# Altium schematic sheet Sheet1.SchDoc
size A3; SheetNumber: 1; SheetTotal: 1
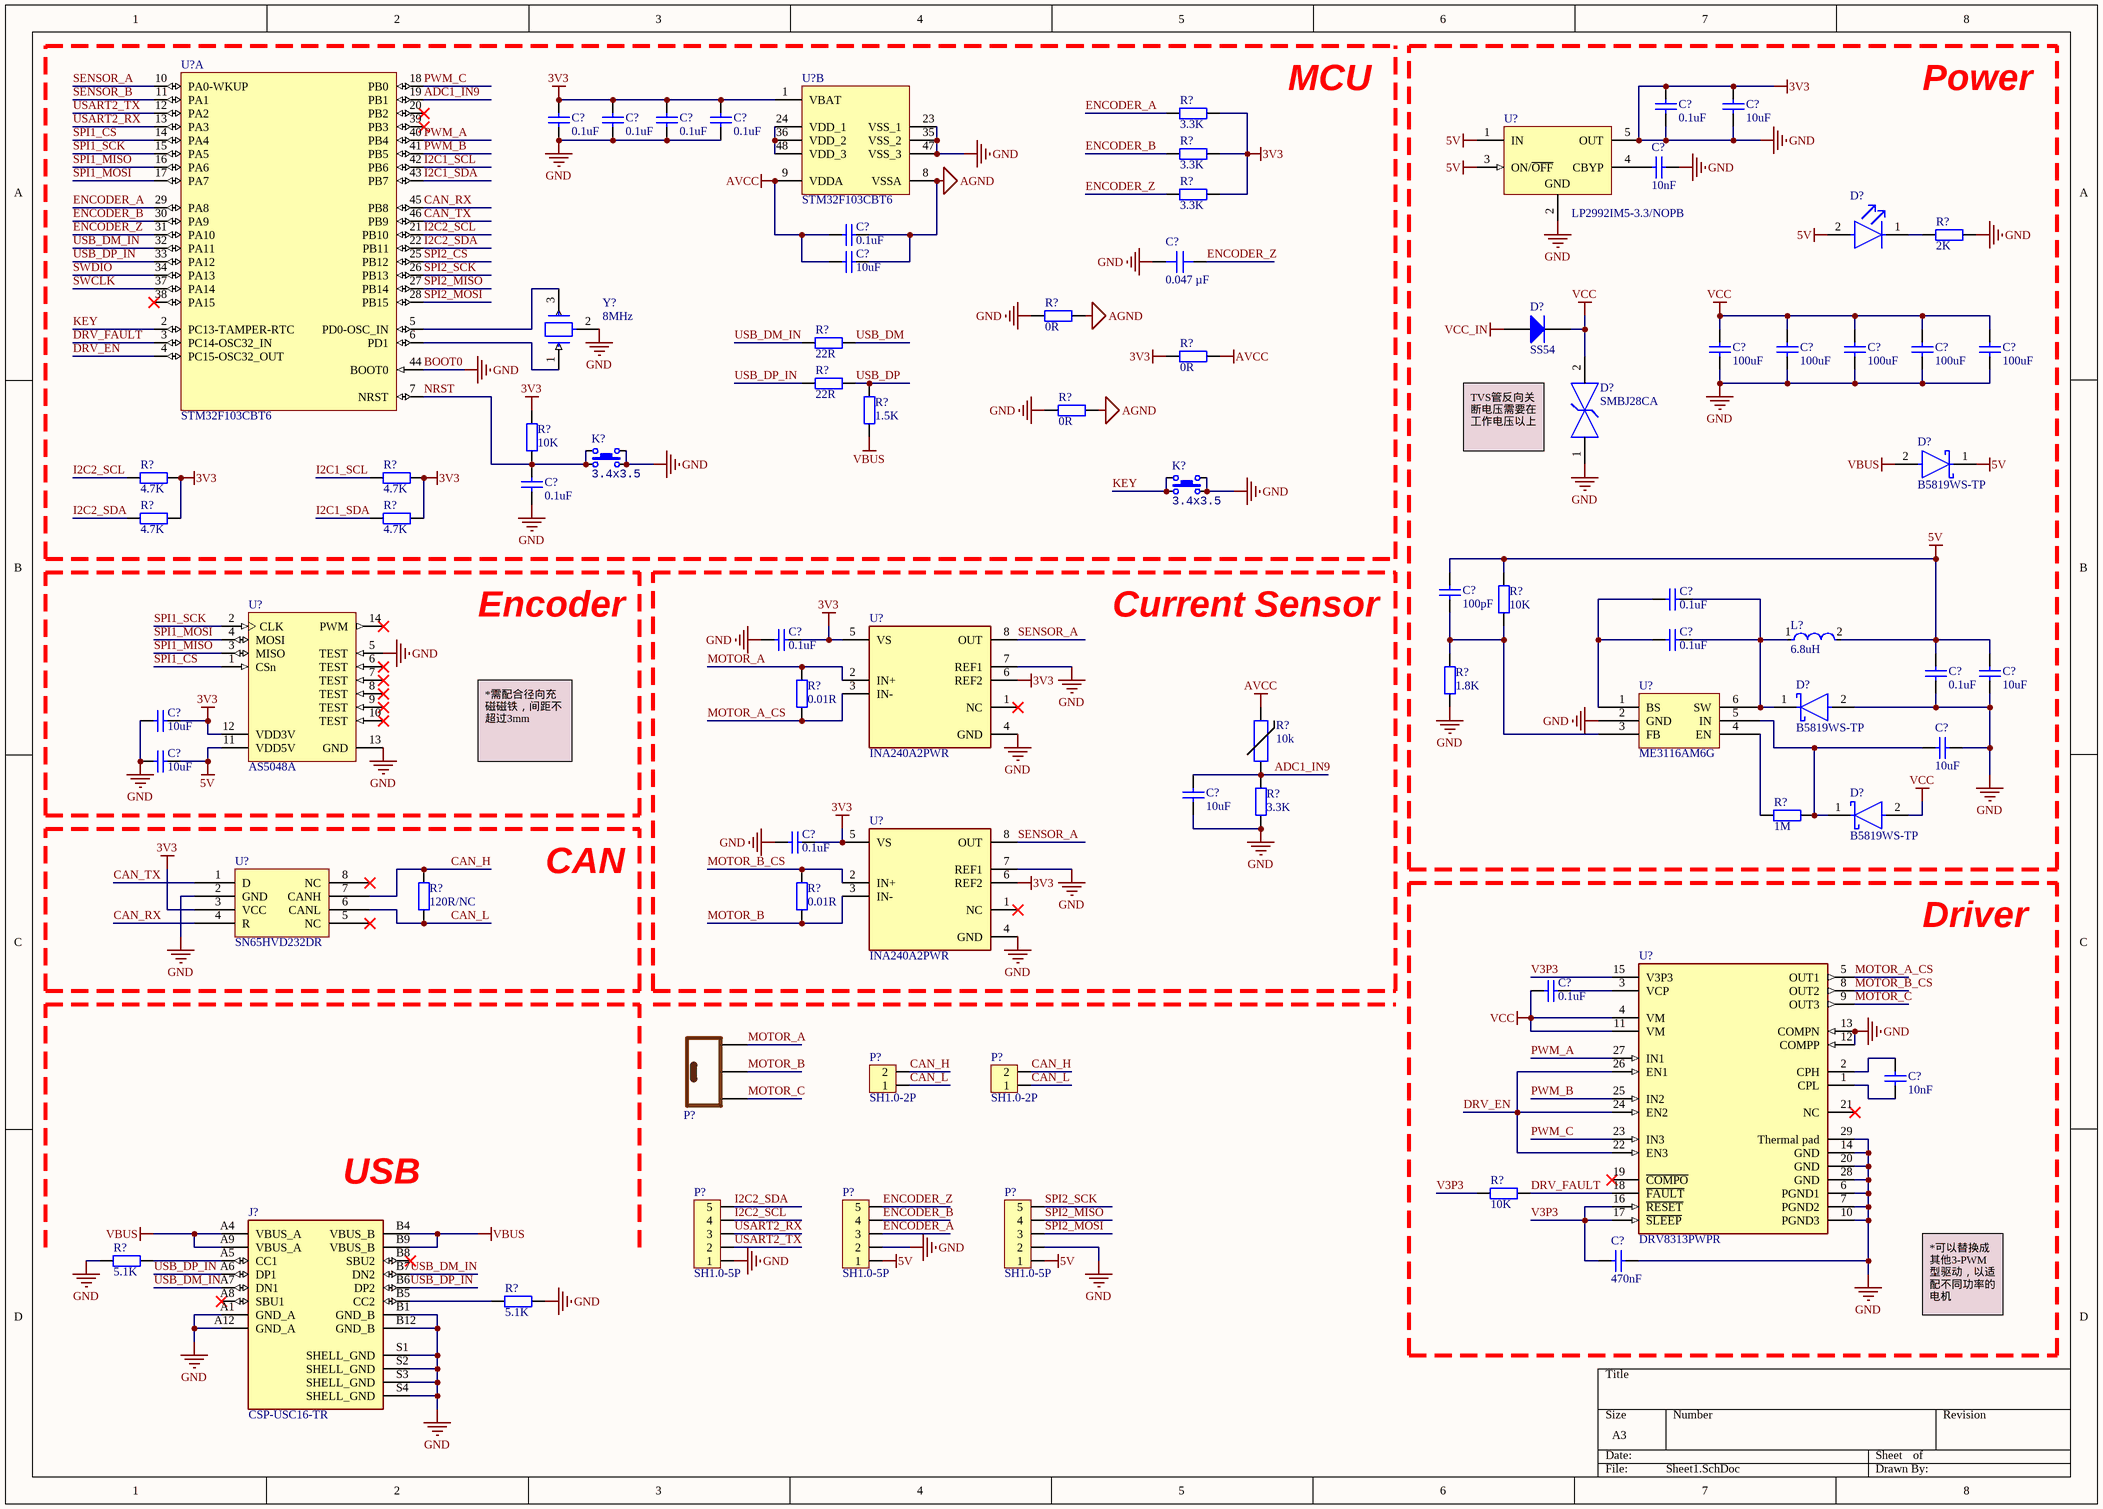
[diagram p0: Sheet1.SchDoc]

## Parts
(Parts that share a designator on the sheet are numbered #1, #2 ... from top to bottom, then left to right.)
C?#1  0.1uF  [0402_C]
C?#2  0.1uF  [0402_C]
C?#3  0.1uF  [0402_C]
C?#4  0.1uF  [0402_C]
C?#5  0.1uF  [0402_C]
C?#6  10uF  [0402_C]
C?#7  10nF  [0402_C]
C?#8  0.1uF  [0402_C]
C?#9  10uF  [0402_C]
C?#10  0.047 µF  [CAP 0402_1005]
C?#11  100uF  [CAPC3216X190X55LL30T25]
C?#12  100uF  [CAPC3216X190X55LL30T25]
C?#13  100uF  [CAPC3216X190X55LL30T25]
C?#14  100uF  [CAPC3216X190X55LL30T25]
C?#15  100uF  [CAPC3216X190X55LL30T25]
C?#16  0.1uF  [0402_C]
C?#17  0.1uF  [0402_C]
C?#18  0.1uF  [0402_C]
C?#19  0.1uF  [0402_C]
C?#20  100pF  [0402_C]
C?#21  0.1uF  [0402_C]
C?#22  10uF  [0402_C]
C?#23  10uF  [0402_C]
C?#24  10uF  [0402_C]
C?#25  10uF  [0402_C]
C?#26  10uF  [0402_C]
C?#27  0.1uF  [0402_C]
C?#28  0.1uF  [0402_C]
C?#29  10nF  [0402_C]
C?#30  470nF  [0402_C]
D?#1  (no value)  [FP-APHHS1005CGCK-MFG]
D?#2  SS54  [SMA(DO-214AC)_S1]
D?#3  SMBJ28CA  [FP-SMBJ-CA-MFG]
D?#4  B5819WS-TP  [FP-SOD-323-IPC_C]
D?#5  B5819WS-TP  [FP-SOD-323-IPC_C]
D?#6  B5819WS-TP  [FP-SOD-323-IPC_C]
J?  CSP-USC16-TR  [VALCON_CSP-USC16-TR]
K?#1  value 3.4x3.5  [ButtonTACT_3.5*3.55_90]  (hidden comment: TACT 4P)
K?#2  value 3.4x3.5  [ButtonTACT_3.5*3.55_90]  (hidden comment: TACT 4P)
L?  6.8uH  [FP-LQH2MCN_52-MFG]
P?#1  SH1.0-2P  [SH1.0-2P]
P?#2  SH1.0-2P  [SH1.0-2P]
P?#3  电机接插件-3P  [AMASS-MR30-M]  (value not drawn)
P?#4  SH1.0-5P  [SH1.0-5P]
P?#5  SH1.0-5P  [SH1.0-5P]
P?#6  SH1.0-5P  [SH1.0-5P]
R?#1  3.3K  [0402_R]
R?#2  3.3K  [0402_R]
R?#3  3.3K  [0402_R]
R?#4  2K  [0402_R]
R?#5  0R  [0402_R]
R?#6  22R  [0402_R]
R?#7  0R  [0402_R]
R?#8  22R  [0402_R]
R?#9  1.5K  [0402_R]
R?#10  0R  [0402_R]
R?#11  10K  [0402_R]
R?#12  4.7K  [0402_R]
R?#13  4.7K  [0402_R]
R?#14  4.7K  [0402_R]
R?#15  4.7K  [0402_R]
R?#16  10K  [0402_R]
R?#17  1.8K  [0402_R]
R?#18  0.01R  [0402_R]
R?#19  value 10k  [RES_0402]  (hidden comment: NCP15XH103F03RC)
R?#20  3.3K  [0402_R]
R?#21  1M  [0402_R]
R?#22  120R/NC  [0402_R]
R?#23  0.01R  [0402_R]
R?#24  10K  [0402_R]
R?#25  5.1K  [0402_R]
R?#26  5.1K  [0402_R]
U?#1  STM32F103CBT6  [LQFP-48_7x7x05P]  (part B of 2)
U?#2  LP2992IM5-3.3/NOPB  [DBV0005A_L]
U?#3  STM32F103CBT6  [LQFP-48_7x7x05P]  (part A of 2)
U?#4  INA240A2PWR  [FP-PW0008A-MFG]
U?#5  AS5048A  [TSSOP-14]
U?#6  ME3116AM6G  [SOT-23-6]
U?#7  INA240A2PWR  [FP-PW0008A-MFG]
U?#8  Manufacturer Part Number: SN65HVD232DR  [SO-8]  (hidden comment: SN65HVD232D)
U?#9  DRV8313PWPR  [FP-PWP0028C-IPC_B]
Y?  8MHz  [FP-CSTNE8M00GH5C000R0-MFG]

## Blocks framed on the sheet
MCU: C?#1-C?#4 C?#8-C?#10 C?#16 K?#1 K?#2 R?#1-R?#3 R?#5-R?#15 U?#1 U?#3 Y?
Power: C?#5-C?#7 C?#11-C?#15 C?#17 C?#18 C?#20 C?#21 C?#23 C?#25 D?#1-D?#6 L? R?#4 R?#16 R?#17 R?#21 U?#2 U?#6
Encoder: C?#22 C?#26 U?#5
Current Sensor: C?#19 C?#24 C?#27 R?#18-R?#20 R?#23 U?#4 U?#7
CAN: R?#22 U?#8
Driver: C?#28-C?#30 R?#24 U?#9

## Nets
5V: C?#18.1 C?#20.2 C?#23.2 C?#26.1 D?#1.2(A) D?#4.1(C) L?.2 P?#5.1 P?#6.1 R?#16.2 U?#2.1(IN) U?#2.3(ON/~{OFF}) U?#5.11(VDD5V)
AGND: C?#8.1 C?#9.1 R?#5.2 R?#10.2 U?#1.8(VSSA)
AVCC: C?#8.2 C?#9.2 R?#7.2 R?#19.2 U?#1.9(VDDA)
BOOT0: C?#1.1 C?#1.2 C?#2.1 C?#2.2 C?#3.1 C?#3.2 C?#4.1 C?#4.2 C?#5.1 C?#5.2 C?#6.1 C?#6.2 C?#7.1 C?#10.1 C?#11.1 C?#12.1 C?#13.1 C?#14.1 C?#15.1 C?#16.2 C?#18.2 C?#19.1 C?#19.2 C?#22.1 C?#22.2 C?#23.1 C?#24.2 C?#25.1 C?#26.2 C?#27.1 C?#27.2 C?#30.2 D?#3.1 D?#5.2(A) J?.A1(GND_A) J?.A12(GND_A) J?.B1(GND_B) J?.B12(GND_B) J?.S1(SHELL_GND) J?.S2(SHELL_GND) J?.S3(SHELL_GND) J?.S4(SHELL_GND) K?#1.2 K?#1.4 K?#2.2 K?#2.4 P?#4.1 P?#5.2 P?#6.2 R?#1.2 R?#2.2 R?#3.2 R?#4.2 R?#5.1 R?#7.1 R?#10.1 R?#11.2 R?#12.2 R?#13.2 R?#14.2 R?#15.2 R?#17.1 R?#20.1 R?#25.2 R?#26.1 U?#1.1(VBAT) U?#1.23(VSS_1) U?#1.35(VSS_2) U?#1.47(VSS_3) U?#2.2(GND) U?#2.5(OUT) U?#3.44(BOOT0) U?#4.4(GND) U?#4.5(VS) U?#4.6(REF2) U?#4.7(REF1) U?#5.5(TEST) U?#5.12(VDD3V) U?#5.13(GND) U?#6.2(GND) U?#7.4(GND) U?#7.5(VS) U?#7.6(REF2) U?#7.7(REF1) U?#8.2(GND) U?#8.3(VCC) U?#9.6(PGND1) U?#9.7(PGND2) U?#9.10(PGND3) U?#9.12(COMPP) U?#9.13(COMPN) U?#9.14(GND) U?#9.20(GND) U?#9.28(GND) U?#9.29(Thermal_pad) Y?.2(GND)  [also labelled 3V3, GND]
VBUS: D?#4.2(A) J?.A4(VBUS_A) J?.A9(VBUS_A) J?.B4(VBUS_B) J?.B9(VBUS_B) R?#9.1
VCC: C?#11.2 C?#12.2 C?#13.2 C?#14.2 C?#15.2 C?#28.2 D?#2.2(K) D?#3.2 D?#6.2(A) U?#9.4(VM) U?#9.11(VM)
VCC_IN: D?#2.1(A)
ADC1_IN9: C?#24.1 R?#19.1 R?#20.2 U?#3.19(PB1)
CAN_H: P?#1.2 P?#2.2 R?#22.2 U?#8.7(CANH)
CAN_L: P?#1.1 P?#2.1 R?#22.1 U?#8.6(CANL)
CAN_RX: U?#3.45(PB8) U?#8.4(R)
CAN_TX: U?#3.46(PB9) U?#8.1(D)
DRV_EN: U?#3.4(PC15-OSC32_OUT) U?#9.22(EN3) U?#9.24(EN2) U?#9.26(EN1)
DRV_FAULT: R?#24.1 U?#3.3(PC14-OSC32_IN) U?#9.18(~{FAULT})
ENCODER_A: P?#5.3 R?#1.1 U?#3.29(PA8)
ENCODER_B: P?#5.4 R?#2.1 U?#3.30(PA9)
ENCODER_Z: C?#10.2 P?#5.5 R?#3.1 U?#3.31(PA10)
I2C1_SCL: R?#13.1 U?#3.42(PB6)
I2C1_SDA: R?#15.1 U?#3.43(PB7)
I2C2_SCL: P?#4.4 R?#12.1 U?#3.21(PB10)
I2C2_SDA: P?#4.5 R?#14.1 U?#3.22(PB11)
KEY: K?#2.1 K?#2.3 U?#3.2(PC13-TAMPER-RTC)
MOTOR_A: P?#3.3 R?#18.2 U?#4.2(IN+)
MOTOR_A_CS: R?#18.1 U?#4.3(IN-) U?#9.5(OUT1)
MOTOR_B: P?#3.2 R?#23.1 U?#7.3(IN-)
MOTOR_B_CS: R?#23.2 U?#7.2(IN+) U?#9.8(OUT2)
MOTOR_C: P?#3.1 U?#9.9(OUT3)
NRST: C?#16.1 K?#1.1 K?#1.3 R?#11.1 U?#3.7(NRST)
PWM_A: U?#3.40(PB4) U?#9.27(IN1)
PWM_B: U?#3.41(PB5) U?#9.25(IN2)
PWM_C: U?#3.18(PB0) U?#9.23(IN3)
SENSOR_A: U?#3.10(PA0-WKUP) U?#4.8(OUT) U?#7.8(OUT)
SENSOR_B: U?#3.11(PA1)
SPI1_CS: U?#3.14(PA4) U?#5.1(CSn)
SPI1_MISO: U?#3.16(PA6) U?#5.3(MISO)
SPI1_MOSI: U?#3.17(PA7) U?#5.4(MOSI)
SPI1_SCK: U?#3.15(PA5) U?#5.2(CLK)
SPI2_CS: U?#3.25(PB12)
SPI2_MISO: P?#6.4 U?#3.27(PB14)
SPI2_MOSI: P?#6.3 U?#3.28(PB15)
SPI2_SCK: P?#6.5 U?#3.26(PB13)
SWCLK: U?#3.37(PA14)
SWDIO: U?#3.34(PA13)
USART2_RX: P?#4.3 U?#3.13(PA3)
USART2_TX: P?#4.2 U?#3.12(PA2)
USB_DM: R?#6.2
USB_DM_IN: J?.A7(DN1) J?.B7(DN2) R?#6.1 U?#3.32(PA11)
USB_DP: R?#8.2 R?#9.2
USB_DP_IN: J?.A6(DP1) J?.B6(DP2) R?#8.1 U?#3.33(PA12)
V3P3: C?#30.1 R?#24.2 U?#9.15(V3P3) U?#9.16(~{RESET}) U?#9.17(~{SLEEP})
NetC?#7_2: C?#7.2 U?#2.4(CBYP)
NetC?#17_1: C?#17.1 C?#21.1 D?#5.1(C) L?.1 U?#6.6(SW)
NetC?#17_2: C?#17.2 C?#21.2 U?#6.1(BS)
NetC?#20_1: C?#20.1 R?#16.1 R?#17.2 U?#6.3(FB)
NetC?#25_2: C?#25.2 D?#6.1(C) R?#21.1 U?#6.5(IN)
NetC?#28_1: C?#28.1 U?#9.3(VCP)
NetC?#29_1: C?#29.1 U?#9.1(CPL)
NetC?#29_2: C?#29.2 U?#9.2(CPH)
NetD?#1_1: D?#1.1(C) R?#4.1
NetJ?_A5: J?.A5(CC1) R?#25.1
NetJ?_B5: J?.B5(CC2) R?#26.2
NetR?#21_2: R?#21.2 U?#6.4(EN)
NetU?#1_24: U?#1.24(VDD_1) U?#1.36(VDD_2) U?#1.48(VDD_3)
NetU?#3_5: U?#3.5(PD0-OSC_IN) Y?.3(Output)
NetU?#3_6: U?#3.6(PD1) Y?.1(Input)

Not connected (* = marked no-connect by the designer): J? A8(SBU1)* B8(SBU2)*; U?#3 20(PB2)* 38(PA15)* 39(PB3)*; U?#4 1(NC)*; U?#5 6(TEST)* 7(TEST)* 8(TEST)* 9(TEST)* 10(TEST)* 14(PWM)*; U?#7 1(NC)*; U?#8 5(NC)* 8(NC)*; U?#9 19(~{COMPO})* 21(NC)*

## Notes on the sheet
- (near D?#3) TVS管反向关断电压需要在工作电压以上
- *需配合径向充磁磁铁，间距不超过3mm
- (near J?) USB
- *可以替换成其他3-PWM型驱动，以适配不同功率的电机

## Library data of the parts
C?#1-C?#9 C?#16-C?#19 C?#21-C?#28 = 0402 100nF (104) 10% 16V: 贴片电容; ComponentLink1Description: 供应商链接; ComponentLink1URL: http://www.szlcsc.com/product/details_1877.html; Package: 0402; Supplier: LC; SuppliersPartNumber: C1525
C?#10 = C0402C473K3REC7867: CAP CER 0402 47NF 25V X7R 10%; manufacturer: KEMET; Part Number: C0402C473K3REC7867; Value: 0.047 µF; Applications: ESD Protection; Capacitance: 0.047 µF; componentlink1description: Datasheet; componentlink1url: https://api.kemet.com/component-edge/download/datasheet/C0402C473K3REC7867.pdf; componentlink2description: DigiKey Link; componentlink2url: https://www.digikey.com/en/products/detail/kemet/C0402C473K3REC7867/8643594; Device Package: 0402 (1005 Metric); lastupdated: 2022/8/26 11:23:32; Lifecycle Status: Active; Minimum Order: 1; Mounting Type: Surface Mount, MLCC; Operating Temperature: -55°C ~ 125°C; Package / Case: 0402 (1005 Metric); packaging: TapeAndReel; partid: 33555; Part Status: Active; price: 0.01; series: ESD SMD Comm X7R; Size / Dimension: 0.039" L x 0.020" W (1.00mm x 0.50mm); Supplier 1: DigiKey; Supplier Part Number 1: 399-C0402C473K3REC7867CT-ND; Temperature Coefficient: X7R; Thickness (Max): 0.022" (0.55mm); Tolerance: ±10%; Voltage - Rated: 25V
C?#11-C?#15 = CMP-1662-00011-2: Chip Capacitor, 100 uF, +/- 20%, 6.3 V, -55 to 85 degC, 1206 (3216 Metric), RoHS, Tape and Reel; PartNumber: GRM31CR60J107ME39L; Case\/Package: 1206; Voltage Rating (DC): 6.3 V; Type (Capacitors): X5R; REACH SVHC: No SVHC; Height: 1.6 mm; Tolerance: 20%; Packaging: Tape and Reel; Mount: Surface Mount; PackageDescription: 2-Pin Surface Mount Device, Body 3.2 x 1.6 mm; ComponentLink1URL: http://www.murata.com/; Pins: 2; ComponentLink2Description: Datasheet; PackageReference: 1206; Width: 1.6 mm; Package Quantity: 2000; Capacitance: 100 uF; Min Operating Temperature: -55 degC; Case Code (Imperial): 1206; Max Operating Temperature: 85 degC; DatasheetVersion: 09/2016; Mounting Technology: Surface Mount; Voltage Rating: 6.3 V; ComponentLink1Description: Manufacturer URL; Radiation Hardening: No; Case Code (Metric): 3216; Length: 3.2 mm; ComponentLink2URL: http://psearch.en.murata.com/capacitor/product/GRM31CR60J107ME39%23.pdf; RoHSCompliant: true
C?#20 = 0402 100pF (101) 5% 50V: 贴片电容; ComponentLink1Description: 供应商链接; ComponentLink1URL: http://www.szlcsc.com/product/details_1898.html; Package: 0402; Supplier: LC; SuppliersPartNumber: C1546
C?#29 = 0402 10nF (103) 10% 50V: 贴片电容; ComponentLink1Description: 供应商链接; ComponentLink1URL: http://www.szlcsc.com/product/details_15869.html; Package: 0402; Supplier: LC; SuppliersPartNumber: C15195
C?#30 = 0402 470nF (474) 10% 10V: 贴片电容; ComponentLink1Description: 供应商链接; ComponentLink1URL: http://www.szlcsc.com/product/details_48344.html; Package: 0402; Supplier: LC; SuppliersPartNumber: C47339
D?#1 = CMP-44529-000044-1: LED GREEN CLEAR CHIP SMD; Viewing Angle: 120°; Dominant Wavelength: 570nm; Test Current: 20mA; Luminous Intensity: 50mcd; Forward Voltage: 2.1V; Number of LEDs: 1; Lens Color: Clear; Packaging: Tape and Reel; Max Operating Temperature: 85°C; Illumination Color: Green; Length: 1mm; Mount: Surface Mount; Lens Style: Clear; Color: Green; Number of Pins: 2; Wavelength: 570nm; Case/Package: 0402; Width: 0.5mm; Package Quantity: 2000; Case Code (Metric): 1005; Height: 0.6mm; Lead Free: Lead Free; Case Code (Imperial): 0402; Forward Current: 20mA; Min Operating Temperature: -40°C
D?#2 = SMA(DO-214AC) SS54: 二极管; ComponentLink1Description: 供应商链接; ComponentLink1URL: http://www.szlcsc.com/product/details_23178.html; Package: SMA(DO-214AC); Supplier: LC; SuppliersPartNumber: C22452
D?#3 = CMP-08607-000057-1: TVS DIODE 28V 45.4V DO214AA; Manufacturer: Littelfuse Inc; Direction: Bidirectional; Peak Pulse Power: 600W; Max Junction Temp: +150°C; Peak Pulse Current: 13.3A; Breakdown Voltage: 31.1V; Number Of Channels: 1; Digikey Description: TVS DIODE 28V 45.4V DO214AA; Temperature Range Low: -65°C; Device Class L1: Circuit Protection; Automotive: No; Device Class L3: unset; Octopart: https://octopart.com/smbj28ca-littelfuse-350757; Temperature Range High: +150°C; Reverse Standoff Voltage: 28V; Mouser Description: In a Pack of 10, Littelfuse SMBJ28CA, Bi-Directional TVS Diode, 600W, 2-Pin DO-214AA; Category: Diode; Device Class L2: TVS Diodes; ComponentLink2URL: https://www.littelfuse.com/~/media/electronics/datasheets/tvs_diodes/littelfuse_tvs_diode_smbj_datasheet.pdf.pdf; Clamping Voltage: 45.4V; Manufacturer Part Number: SMBJ28CA; RoHS: TRUE; Height: 2.61mm; Package: SMBJ-CA; ComponentLink2Description: Datasheet; Lead Free: Yes; Temperature: -65°C to +150°C
D?#4-D?#6 = CMP-56206-000009-1: DIODE SCHOTTKY 40V 1A SOD323; Max Reverse Leakage Current: 1mA; Peak Non-Repetitive Surge Current: 10A; Forward Voltage: 900mV; Element Configuration: Single; Max Reverse Voltage (DC): 40V; Number of Pins: 2; Max Operating Temperature: 125°C; Package Quantity: 1; Radiation Hardening: No; Average Rectified Current: 1A; Lead Free: Lead Free; Series: -; Mount: Surface Mount; Min Operating Temperature: -65°C; RoHS Compliant: Yes; Packaging: Tape and Reel; Max Surge Current: 10A
J? = CSP-USC16-TR: CSP-USC16-TR Valcon USB Type C Surface Mount PCB Socket; Package: None; Purchase-URL: https://pricing.snapeda.com/search/part/CSP-USC16-TR/?ref=eda; MP: CSP-USC16-TR; Check_prices: https://www.snapeda.com/parts/CSP-USC16-TR/Valcon/view-part/4783629/?ref=eda; MF: Valcon; Value: *; Availability: No availability data; Price: None; SnapEDA_Link: https://www.snapeda.com/parts/CSP-USC16-TR/Valcon/view-part/4783629/?ref=snap
K?#1 K?#2 = ButtonTACT: Button; type: TACT 4P
L? = CMP-06042-015166-1: Wire Wound Ferrite Inductor for Power Lines 6.8μH ±20% 1.6Ω 285mA 0806; Shielding: Unshielded; Test Frequency: 1MHz; Self Resonant Frequency: 65MHz; DC Resistance (DCR): 1.6R; Military Standard: Not; Length: 2mm; Case Code (Metric): 2016; Current Rating: 285mA; Package Quantity: 3000; Weight: 0.000317oz; Case Code (Imperial): 0806; Max Operating Temperature: 85°C; Width: 0.063inch; DC Current: 285mA; Core Material: Ferrite; Resistor Type: Wirewound; Inductance: 6.8uH; Height - Seated (Max): 0.037inch; Max DC Current: 285mA; Depth: 1.8mm; Termination: SMD/SMT; Min Operating Temperature: -40°C; Case/Package: 0806; Mount: Surface Mount; Tolerance: 20%; Packaging: Tape and Reel; Height: 0.9mm; Radiation Hardening: No
P?#3 = 电机接插件-3P: AMASS MR30
R?#1-R?#3 R?#20 = 0402 3.3KΩ (3301) 1%: 贴片电阻; ComponentLink1Description: 供应商链接; ComponentLink1URL: http://www.szlcsc.com/product/details_26633.html; Package: 0402; Supplier: LC; SuppliersPartNumber: C25890
R?#4 R?#21 = 0402 2KΩ (2001) 1%: 贴片电阻; ComponentLink1Description: 供应商链接; ComponentLink1URL: http://www.szlcsc.com/product/details_4516.html; Package: 0402; Supplier: LC; SuppliersPartNumber: C4109
R?#5 R?#7 R?#10 = 0402 0Ω (0R0) 1%: 贴片电阻; ComponentLink1Description: 供应商链接; ComponentLink1URL: http://www.szlcsc.com/product/details_17853.html; Package: 0402; Supplier: LC; SuppliersPartNumber: C17168
R?#6 R?#8 R?#18 R?#23 = 0402 22Ω (22R0) 1%: 贴片电阻; ComponentLink1Description: 供应商链接; ComponentLink1URL: http://www.szlcsc.com/product/details_25835.html; Package: 0402; Supplier: LC; SuppliersPartNumber: C25092
R?#9 = 0402 1.5KΩ (1501) 1%: 贴片电阻; ComponentLink1Description: 供应商链接; ComponentLink1URL: http://www.szlcsc.com/product/details_26610.html; Package: 0402; Supplier: LC; SuppliersPartNumber: C25867
R?#11 = 0402 10KΩ (1002) 1%: 贴片电阻; ComponentLink1Description: 供应商链接; ComponentLink1URL: http://www.szlcsc.com/product/details_26487.html; Package: 0402; Supplier: LC; SuppliersPartNumber: C25744
R?#12-R?#15 = 0402 4.7KΩ (4701) 1%: 贴片电阻; ComponentLink1Description: 供应商链接; ComponentLink1URL: http://www.szlcsc.com/product/details_26643.html; Package: 0402; Supplier: LC; SuppliersPartNumber: C25900
R?#16 R?#17 R?#24-R?#26 = 0402 1.2KΩ (1201) 1%: 贴片电阻; ComponentLink1Description: 供应商链接; ComponentLink1URL: http://www.szlcsc.com/product/details_26605.html; Package: 0402; Supplier: LC; SuppliersPartNumber: C25862
R?#19 = NCP15XH103F03RC: THERMISTOR 10K OHM NTC 0402 SMD
R?#22 = 0402 120Ω (1200) 1%: 贴片电阻; ComponentLink1Description: 供应商链接; ComponentLink1URL: http://www.szlcsc.com/product/details_25822.html; Package: 0402; Supplier: LC; SuppliersPartNumber: C25079
U?#1 U?#3 = STM32F103CBT6: ARM; ComponentLink1Description: 供应商链接; ComponentLink1URL: http://www.szlcsc.com/product/details_8796.html; Package: LQFP-48_7x7x05P; Supplier: LC; SuppliersPartNumber: C8304
U?#2 = CMP-0062-02175-3: Micropower 250 mA Low-Noise Ultra Low-Dropout Regulator, 5-pin SOT-23, Pb-Free; Manufacturer: Texas Instruments; CompType: LDO IC; PackageTopMarking: LFEB*XTT; PowerWise: N; PackageReference: DBV0005A; ComponentLink1Description: Datasheet URL; RoHS: Y; PackageDescription: Molded SOT-23, .115 x .063 x .040 in Body, 5 Lead, .0375 in Pitch; ComponentLink1URL: http://www.ti.com/general/docs/lit/getliterature.tsp?genericPartNumber=LP2992&fileType=pdf; PinCount: 5
U?#4 U?#7 = CMP-04895-000047-1: IC AMP CURRENT SENSE 8-TSSOP; Manufacturer: Texas Instruments; Voltage Gain: 0.05V/mV; Max Supply Voltage: 5.5V; Max Junction Temp: +150°C; Input Offset Voltage: 0.005mV; Bandwidth: 400kHz; Min Supply Voltage: 2.7V; Nominal Supply Current: 1.8mA; Standoff Height: 0.05mm; Number Of Channels: 1; Input Bias Current: 90uA; ComponentLink2URL: http://www.ti.com/lit/ds/symlink/ina240.pdf; Device Class L2: Linear ICs; ComponentLink2Description: Datasheet; Temperature: -40°C to +125°C; Octopart: https://octopart.com/ina240a2pwr-texas+instruments-75431049; Automotive: No; Manufacturer Part Number: INA240A2PWR; Ambient Temperature Range Low: -40°C; RoHS: TRUE; Package: PW0008A; Device Class L1: Integrated Circuits (ICs); Temperature Range Low: -40°C; Category: IC; Ipc Land Pattern Name: SOP65P300X120-8; Temperature Range High: +125°C; Ambient Temperature Range High: +125°C; Height: 1.2mm; Lead Free: Yes; Device Class L3: Instrumentation; Digikey Description: IC AMP CURRENT SENSE 8-TSSOP
U?#5 = AS5048A: 14 位旋转式位置传感器
U?#6 = ME3116AM6G: DC/DC降压型稳压器
U?#8 = SN65HVD232D: Manufacturer: Texas Instruments; Protocol: CAN; Number of Drivers/Receivers: 1/1; Duplex: Half; Data Rate: 1Mbps; Voltage - Supply: 3 V ~ 3.6 V; Supplier 1: Digi-Key; Supplier Part Number 1: 296-26344-2-ND; RoHS: RoHS Compliant; Category: Integrated Circuits (ICs); Stock: 5000; Pricing 1: 2500=0.84375 (USD); Packaging: Tape & Reel (TR); Part Status: Active; Type: Transceiver; Operating Temperature: -40°C ~ 85°C; Mounting Type: Surface Mount; Package / Case: 8-SOIC (0.154", 3.90mm Width); Supplier Device Package: 8-SOIC; ComponentLink1URL: http://www.ti.com/lit/ds/symlink/sn65hvd230.pdf; ComponentLink1Description: http://www.ti.com/lit/ds/symlink/sn65hvd230.pdf; Supplier 2: Digi-Key; Supplier Part Number 2: 296-26344-1-ND; Pricing 2: 1=2.05, 10=1.842, 100=1.4809, 500=1.21668, 1000=1.00811 (USD)
U?#9 = CMP-04915-000025-1: IC MOTOR DRIVER 8V-60V 28HTSSOP; Min Supply Voltage: 8V; Max Supply Voltage: 60V; Interface: Parallel; Output Current: 1.75A; Number of Outputs: 1; Logic Function: AND GATE; Package Quantity: 2000; Number of Pins: 28; Case/Package: HTSSOP; Min Operating Temperature: -40°C; Mount: Surface Mount; Series: -; Packaging: Tape and Reel; Max Operating Temperature: 125°C; Lead Free: Lead Free
Y? = CMP-06057-000001-1: CERAMIC RES 8.0000MHZ 33PF SMD; Frequency Stability: 0.13%; Frequency Tolerance: 0.07%; Impedance: 40R; Mount: Surface Mount; Min Operating Temperature: -40°C; Max Operating Temperature: 125°C; Resistor Type: Ceramic; Capacitance: 33pF; Packaging: Tape and Reel; Frequency: 8MHz; Case/Package: SMD/SMT